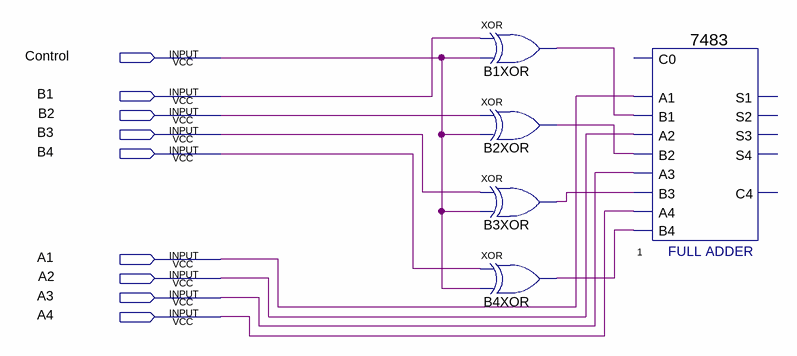
[diagram p0: schematic sheet]
// Quartus schematic ex6_adder_prelab.bdf as structural Verilog: 5 symbols, 9 pins
module ex6_adder_prelab (
  input  Control,
  input  B1,
  input  B2,
  input  B3,
  input  B4,
  input  A1,
  input  A2,
  input  A3,
  input  A4
);

  wire B1XOR_out, B2XOR_out, B3XOR_out, B4XOR_out;

  xor B1XOR (B1XOR_out, B1, Control);
  xor B2XOR (B2XOR_out, B2, Control);
  xor B3XOR (B3XOR_out, B3, Control);
  xor B4XOR (B4XOR_out, B4, Control);
  \7483  u_1 (
    .B4(B4XOR_out), .A1(A1), .A2(A2), .B1(B1XOR_out), .B2(B2XOR_out), .A3(A3), .B3(B3XOR_out), .A4(A4));  // open: C0, S3, S4, S2, C4, S1
endmodule
